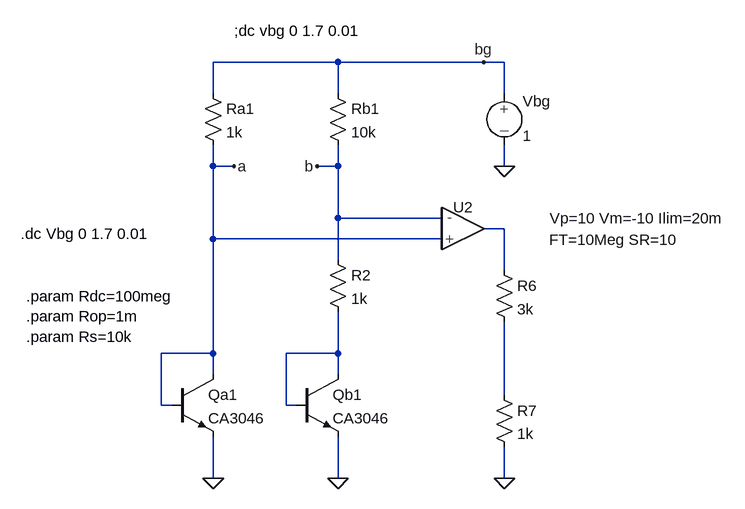
[diagram p0: schematic diodenzelle.asc]
diodenzelle.asc, the LTspice schematic file:
Version 4
SHEET 1 880 680
WIRE -1040 -288 -1232 -288
WIRE -816 -288 -1040 -288
WIRE -784 -288 -816 -288
WIRE -1232 -240 -1232 -288
WIRE -1040 -240 -1040 -288
WIRE -784 -240 -784 -288
WIRE -1232 -128 -1232 -160
WIRE -1200 -128 -1232 -128
WIRE -1040 -128 -1040 -160
WIRE -1040 -128 -1072 -128
WIRE -784 -128 -784 -160
WIRE -1040 -48 -1040 -128
WIRE -880 -48 -1040 -48
WIRE -784 -32 -816 -32
WIRE -1232 -16 -1232 -128
WIRE -880 -16 -1232 -16
WIRE -1040 16 -1040 -48
WIRE -784 32 -784 -32
WIRE -1232 160 -1232 -16
WIRE -1232 160 -1312 160
WIRE -1040 160 -1040 96
WIRE -1040 160 -1120 160
WIRE -1232 192 -1232 160
WIRE -1040 192 -1040 160
WIRE -784 224 -784 112
WIRE -1312 240 -1312 160
WIRE -1296 240 -1312 240
WIRE -1120 240 -1120 160
WIRE -1104 240 -1120 240
WIRE -1232 352 -1232 288
WIRE -1040 352 -1040 288
WIRE -784 352 -784 304
FLAG -1200 -128 a
FLAG -1072 -128 b
FLAG -1040 352 0
FLAG -1232 352 0
FLAG -784 352 0
FLAG -816 -288 bg
FLAG -784 -128 0
SYMBOL EIT_Semiconductors\\npn -1296 192 R0
SYMATTR InstName Qa1
SYMATTR Value CA3046
SYMBOL EIT_Semiconductors\\npn -1104 192 R0
SYMATTR InstName Qb1
SYMATTR Value CA3046
SYMBOL res -1248 -256 R0
SYMATTR InstName Ra1
SYMATTR Value 1k
SYMBOL res -1056 -256 R0
SYMATTR InstName Rb1
SYMATTR Value 10k
SYMBOL res -1056 0 R0
SYMATTR InstName R2
SYMATTR Value 1k
SYMBOL EIT_Semiconductors\\op_3 -848 -32 R0
WINDOW 123 133 17 Left 0
WINDOW 3 134 -16 Left 0
SYMATTR InstName U2
SYMBOL res -800 16 R0
SYMATTR InstName R6
SYMATTR Value 3k
SYMBOL res -800 208 R0
SYMATTR InstName R7
SYMATTR Value 1k
SYMBOL source-V -784 -256 R0
WINDOW 123 0 0 Left 0
WINDOW 39 0 0 Left 0
SYMATTR InstName Vbg
SYMATTR Value 1
TEXT -1200 -336 Left 0 !;dc vbg 0 1.7 0.01
TEXT -1528 -24 Left 0 !.dc Vbg 0 1.7 0.01
TEXT -1520 72 Left 0 !.param Rdc=100meg\n.param Rop=1m\n.param Rs=10k

The netlist it stands for:
* diodenzelle.asc
Qa1 a a 0 0 CA3046
Qb1 N002 N002 0 0 CA3046
Ra1 bg a 1k
Rb1 bg b 10k
R2 b N002 1k
XU2 a b N001 opamp_param_3 Vp=10 Vm=-10 Ilim=20m FT=10Meg SR=10 Vos=0 A0=100k phir=45 en=0 enk=0 in=0 ink=0 Rin=500Meg  ; pins In+ In- OUT
R6 N001 N003 3k
R7 N003 0 1k
Vbg bg 0 1
.model NPN NPN
.model PNP PNP
.lib standard.bjt
;dc vbg 0 1.7 0.01
.dc Vbg 0 1.7 0.01
.param Rdc=100meg
.param Rop=1m
.param Rs=10k
.lib EIT_sub\opamp_parametrierbar.sub
.backanno
.end